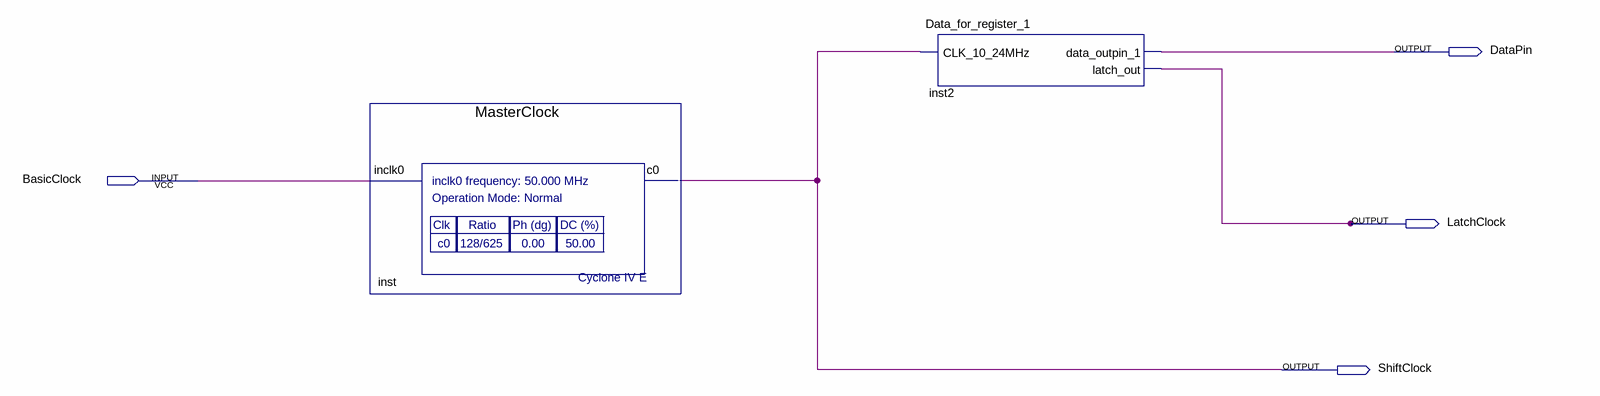
[diagram p0: schematic sheet]
// Quartus schematic BlockDiagram_SonicBoard_ver8.bdf as structural Verilog: 2 symbols, 4 pins
module BlockDiagram_SonicBoard_ver8 (
  input  BasicClock,
  output DataPin,
  output LatchClock,
  output ShiftClock
);

  MasterClock inst (.inclk0(BasicClock), .c0(ShiftClock));
  Data_for_register_1 inst2 (.CLK_10_24MHz(ShiftClock), .data_outpin_1(DataPin), .latch_out(LatchClock));
endmodule
